# EAGLE design band-dsp-micro (EAGLE 7.3.0)
DATABASE: /Users/ingolia/Dropbox/Experiments/turbidostat/nephelometer/circuitry/partsdb.txt
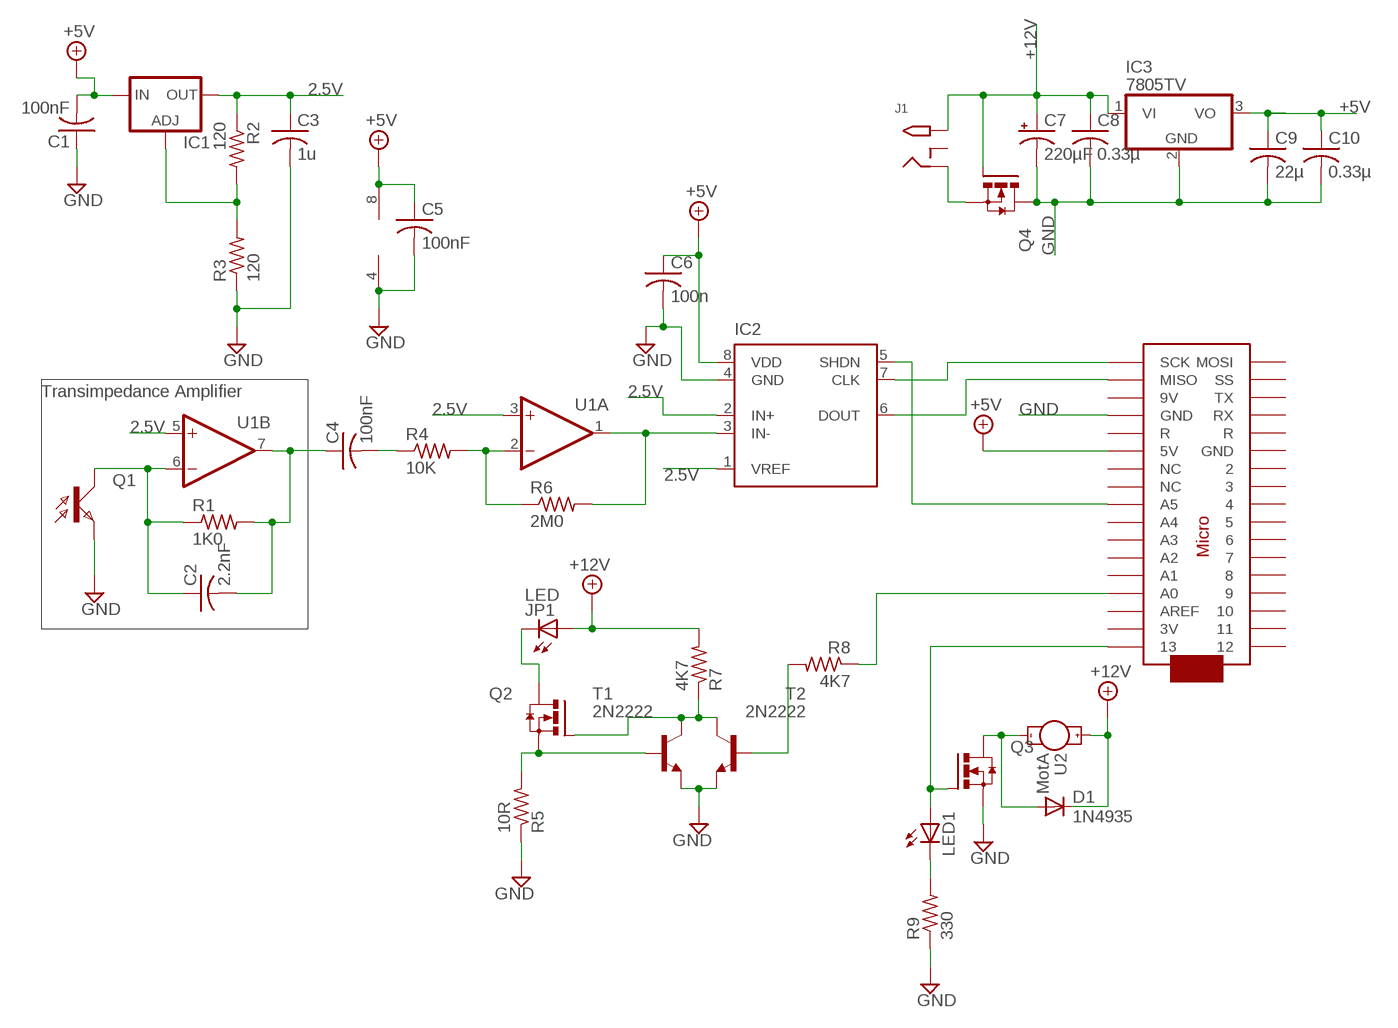
[diagram p0: schematic, sheet 1]

## Parts
C1  100nF  C-US025-025X050  [C025-025X050]
C2  2.2nF  C-US025-024X044  [C025-024X044]
C3  1u  C-US050-024X044  [C050-024X044]
C4  100nF  C-US025-060X050  [C025-060X050]
C5  100nF  C-US025-025X050  [C025-025X050]
C6  100n  C-US025-025X050  [C025-025X050]
C7  220µF  CPOL-USE3.5-8  [E3,5-8]
C8  0.33µ  C-US025-050X050  [C025-050X050]
C9  22µ  C-US050-045X075  [C050-045X075]
C10  0.33µ  C-US025-050X050  [C025-050X050]
D1  1N4935  1N4004  [DO41-10]
IC1  LM317L  [317L]
IC2  MCP3301  [DIL08]
IC3  7805TV  [TO220V]
J1  2.1MMJACKTHM  [PJ-102A]
JP1  LED  LED_CXN  [1X02_SCREW]
LED1  LED3MM  [LED3MM]
Q1  LTR-4206  [3MM_LED]
Q2  IRLB8721  [TO220BV]
Q3  IRLB8721  [TO220BV]
Q4  IRLB8721  [TO220BV]
R1  1K0  R-US_0204/5  [0204/5]
R2  120  R-US_0204/2V  [0204V]
R3  120  R-US_0204/2V  [0204V]
R4  10K  R-US_0204/5  [0204/5]
R5  10R  R-US_0204/2V  [0204V]
R6  2M0  R-US_0309/V  [0309V]
R7  4K7  R-US_0204/2V  [0204V]
R8  4K7  R-US_0204/2V  [0204V]
R9  330  R-US_0204/2V  [0204V]
T1  2N2222  [TO92-EBC-OVAL]
T2  2N2222  [TO92-EBC-OVAL]
U1  LMC6482  [DIL08]
U2  MotA  1X02_MOTOR  [1X02_SCREW]
U3  ARDUINOMICRO  [ARDUINOMICRO]

## Nets
2.5V: C3.1 IC1.2(OUT) IC2.1(VREF) IC2.2(IN+) R2.1 U1.3(A:+IN) U1.5(B:+IN)
+5V: C1.2 C5.1 C6.1 C9.1 C10.1 IC1.3(IN) IC2.8(VDD) IC3.3(VO) U1.8(P:V+) U3.P$23(5V)
+12V: C7.+ C8.1 D1.C IC3.1(VI) J1.TIP JP1.1/POS(A) Q4.G R7.2 U2.1/POS(+)
GND: C1.1 C3.2 C5.2 C6.2 C7.- C8.2 C9.2 C10.2 IC2.4(GND) IC3.2(GND) Q1.A(E) Q3.S Q4.D R3.1 R5.1 R9.1 T1.E T2.E U1.4(P:V-) U3.P$12(GND)
LEDCTRL: R8.2 T2.B
N$1: C2.1 Q1.K(C) R1.1 U1.6(B:-IN)
N$2: C4.2 R4.1
N$3: D1.A Q3.D U2.2(-)
N$4: IC2.6(DOUT) U3.P$19(MISO)
N$5: R8.1 U3.P$31(A0)
N$6: IC2.7(CLK) U3.P$18(SCK)
N$7: IC2.5(SHDN) U3.P$26(A5)
N$8: Q2.G R7.1 T1.C T2.C
N$14: Q2.S R5.2 T1.B
N$16: LED1.K(C) R9.2
N$18: JP1.2(K) Q2.D
N$19: LED1.A Q3.G U3.P$34
N$22: C2.2 C4.1 R1.2 U1.7(B:OUT)
N$25: R4.2 R6.1 U1.2(A:-IN)
N$26: IC2.3(IN-) R6.2 U1.1(A:OUT)
N$35: IC1.1(ADJ) R2.2 R3.2
N$47: J1.RING Q4.S
Unconnected: J1.RING_SW U3.P$1 U3.P$2 U3.P$3 U3.P$4 U3.P$5 U3.P$6 U3.P$7 U3.P$8 U3.P$9 U3.P$10 U3.P$11 U3.P$13(R) U3.P$14(RX) U3.P$15(TX) U3.P$16(SS) U3.P$17(MOSI) U3.P$20(9V) U3.P$21(GND) U3.P$22(R) U3.P$24(NC) U3.P$25(NC) U3.P$27(A4) U3.P$28(A3) U3.P$29(A2) U3.P$30(A1) U3.P$32(AREF) U3.P$33(3V)

## Notes on the sheet
- Transimpedance Amplifier

## Library data of the parts
C1 = adafruit:C-US: CAPACITOR, American symbol; DIGIKEY#: BC1084CT-ND; MANF: Vishay BC Components; MANF#: K104K15X7RF5TL2
C2 = adafruit:C-US: CAPACITOR, American symbol; DIGIKEY#: BC1029CT-ND; MANF: Vishay BC Components; MANF#: K222J15C0GF5TL2
C3 = adafruit:C-US: CAPACITOR, American symbol; DIGIKEY#: 445-8614-ND; MANF: TDK Corporation; MANF#: FK28X7R1C105K
C4 = adafruit:C-US: CAPACITOR, American symbol; DIGIKEY#: 445-8325-ND; MANF: TDK Corporation; MANF#: FK16C0G1H104J
C5 C6 = adafruit:C-US: CAPACITOR, American symbol; DIGIKEY#: BC1084CT-ND
C7 = adafruit:CPOL-US: POLARIZED CAPACITOR, American symbol; DIGIKEY#: P5166-ND; MANF: Panasonic Electronic Components; MANF#: ECA-1VM221
C8 C10 = adafruit:C-US: CAPACITOR, American symbol; DIGIKEY#: 445-5312-ND; MANF: TDK Corporation; MANF#: FK14X7R1H334K
C9 = adafruit:C-US: CAPACITOR, American symbol; DIGIKEY#: 445-8455-ND; MANF: TDK Corporation; MANF#: FK20X7R1C226M
D1 = adafruit:1N4004: DIODE General purpose 1N400x type rectifier (With bigger pads) http://www.ladyada.net/library/pcb/eaglelibrary.html; DIGIKEY#: 1N4935FSCT-ND; MANF: Fairchild Semiconductor; MANF#: 1N4935
IC1 = v-reg:LM317L: VOLTAGE REGULATOR; DIGIKEY#: 296-33312-5-ND; MANF: Texas Instruments; MANF#: LM317LCLP
IC2 = ingolia:MCP3301; DIGIKEY#: MCP3301-BI/P-ND; DIGIKEY2#: AE9986-ND; MANF: Microchip Technology; MANF#: MCP3301-BI/P
IC3 = linear:78*: Positive VOLTAGE REGULATOR Source: http://cache.national.com/ds/LM/LM78L05.pdf http://www.fairchildsemi.com/ds/LM/LM7805.pdf; DIGIKEY#: LM7805CT-ND; MANF: Fairchild Semiconductor; MANF#: LM7805CT
J1 = adafruit:2.1MMJACK: 2.1mm x 5.5mm THM DC jack with internal switch. Digikey part #PJ-102A, 4UCON part #05537 2.1mm x 5.5mm SMT DC jack with internal switch. Digikey part #PJ-002A-SMT, 4UCON part #03267 By microbuilder.eu & adafruit.com; DIGIKEY#: CP-102A-ND; DIGIKEY2#: T1071-P5P-ND; MANF: CUI Inc; MANF#: PJ-102A; MANF2: CUI Inc; MANF2#: EPSA120200U-P5P-SZ
JP1 = ingolia:LED_CXN; DIGIKEY#: 475-3002-ND; DIGIKEY2#: 492-1502-ND; MANF: OSRAM Opto Semiconductors Inc; MANF#: SFH 4547; MANF2: Bivar Inc; MANF2#: CR-174
LED1 = adafruit:LED: LED OSRAM: - CHIPLED LG R971, LG N971, LY N971, LG Q971, LY Q971, LO R971, LY R971 LH N974, LH R974 LS Q976, LO Q976, LY Q976 LO Q996 - Hyper CHIPLED LW Q18S LB Q993, LB Q99A, LB R99A - SideLED LS A670, LO A670, LY A670, LG A670, LP A670 LB A673, LV A673, LT A673, LW A673 LH A674 LY A675 LS A676, LA A676, LO A676, LY A676, LW A676 LS A679, LY A679, LG A679 - Hyper Micro SIDELED® LS Y876, LA Y876, LO Y876, LY Y876 LT Y87S - SmartLED LW L88C, LW L88S LB L89C, LB L89S, LG L890 LS L89K, LO L89K, LY L89K LS L896, LA L896, LO L896, LY L896 - TOPLED LS T670, LO T670, LY T670, LG T670, LP T670 LSG T670, LSP T670, LSY T670, LOP T670, LYG T670 LG T671, LOG T671, LSG T671 LB T673, LV T673, LT T673, LW T673 LH T674 LS T676, LA T676, LO T676, LY T676, LB T676, LH T676, LSB T676, LW T676 LB T67C, LV T67C, LT T67C, LS T67K, LO T67K, LY T67K, LW E67C LS E67B, LA E67B, LO E67B, LY E67B, LB E67C, LV E67C, LT E67C LW T67C LS T679, LY T679, LG T679 LS T770, LO T770, LY T770, LG T770, LP T770 LB T773, LV T773, LT T773, LW T773 LH T774 LS E675, LA E675, LY E675, LS T675 LS T776, LA T776, LO T776, LY T776, LB T776 LHGB T686 LT T68C, LB T68C - Hyper Mini TOPLED® LB M676 - Mini TOPLED Santana® LG M470 LS M47K, LO M47K, LY M47K Source: http://www.osram.convergy.de/; DIGIKEY#: 160-1139-ND; MANF: Lite-On Inc; MANF#: LTL-4221N
Q1 = ingolia:LTR-4206; DIGIKEY#: 160-1030-ND; MANF: Lite-On Inc; MANF#: LTR-4206E
Q2 = ingolia:IRLB8721; DIGIKEY#: IRLB8721PBF-ND
Q3 Q4 = ingolia:IRLB8721; DIGIKEY#: IRLB8721PBF-ND; MANF: International Rectifier; MANF#: IRLB8721PBF
R1 = adafruit:R-US_: RESISTOR, American symbol; DIGIKEY#: S1KCACT-ND; MANF: Stackpole Electronics Inc; MANF#: RNMF14FTC1K00
R2 R3 = adafruit:R-US_: RESISTOR, American symbol; DIGIKEY#: S120CACT-ND; MANF: Stackpole Electronics Inc; MANF#: RNMF14FTC120R
R4 = adafruit:R-US_: RESISTOR, American symbol; DIGIKEY#: S10KCACT-ND; MANF: Stackpole Electronics Inc; MANF#: RNMF14FTC10K0
R5 = adafruit:R-US_: RESISTOR, American symbol; DIGIKEY#: PPC10W-1CT-ND; MANF: Vishay BC Components; MANF#: PR01000101009JR500
R6 = adafruit:R-US_: RESISTOR, American symbol; DIGIKEY#: RNV14FAL2M00TB-ND; MANF: Stackpole Electronics Inc; MANF#: RNV14FAL2M00
R7 R8 = adafruit:R-US_: RESISTOR, American symbol; DIGIKEY#: S4.7KQCT-ND; MANF: Stackpole Electronics Inc; MANF#: CFM14JT4K70
R9 = adafruit:R-US_: RESISTOR, American symbol; DIGIKEY#: CF14JT330RCT-ND; MANF: Stackpole Electronics Inc; MANF#: CF14JT330R
T1 T2 = adafruit:2N2222: NPN TRANSISTOR Big oval pads; DIGIKEY#: PN2222ATFCT-ND; MANF: Fairchild Semiconductor; MANF#: PN2222ATF
U1 = ingolia:LMC6482; DIGIKEY#: LMC6482AIN/NOPB-ND; DIGIKEY2#: AE9986-ND; MANF: Texas Instruments; MANF#: LMC6482AIN/NOPB
U2 = ingolia:1X02_MOTOR; DIGIKEY#: SC1455-ND; MANF: Switchcraft Inc.; MANF#: 35PM1
U3 = adafruit:ARDUINOMICRO; DIGIKEY#: 1050-1066-ND; DIGIKEY2#: S7050-ND; DIGIKEY3#: S7050-ND; DIGIKEY4#: AE10419-ND; MANF: Arduino; MANF#: A000053; MANF2: Sullins Connector Solutions; MANF2#: PPPC171LFBN-RC; MANF3: Sullins Connector Solutions; MANF3#: PPPC171LFBN-RC; MANF4: Assmann WSW Components; MANF4#: AK67421-1

## Board
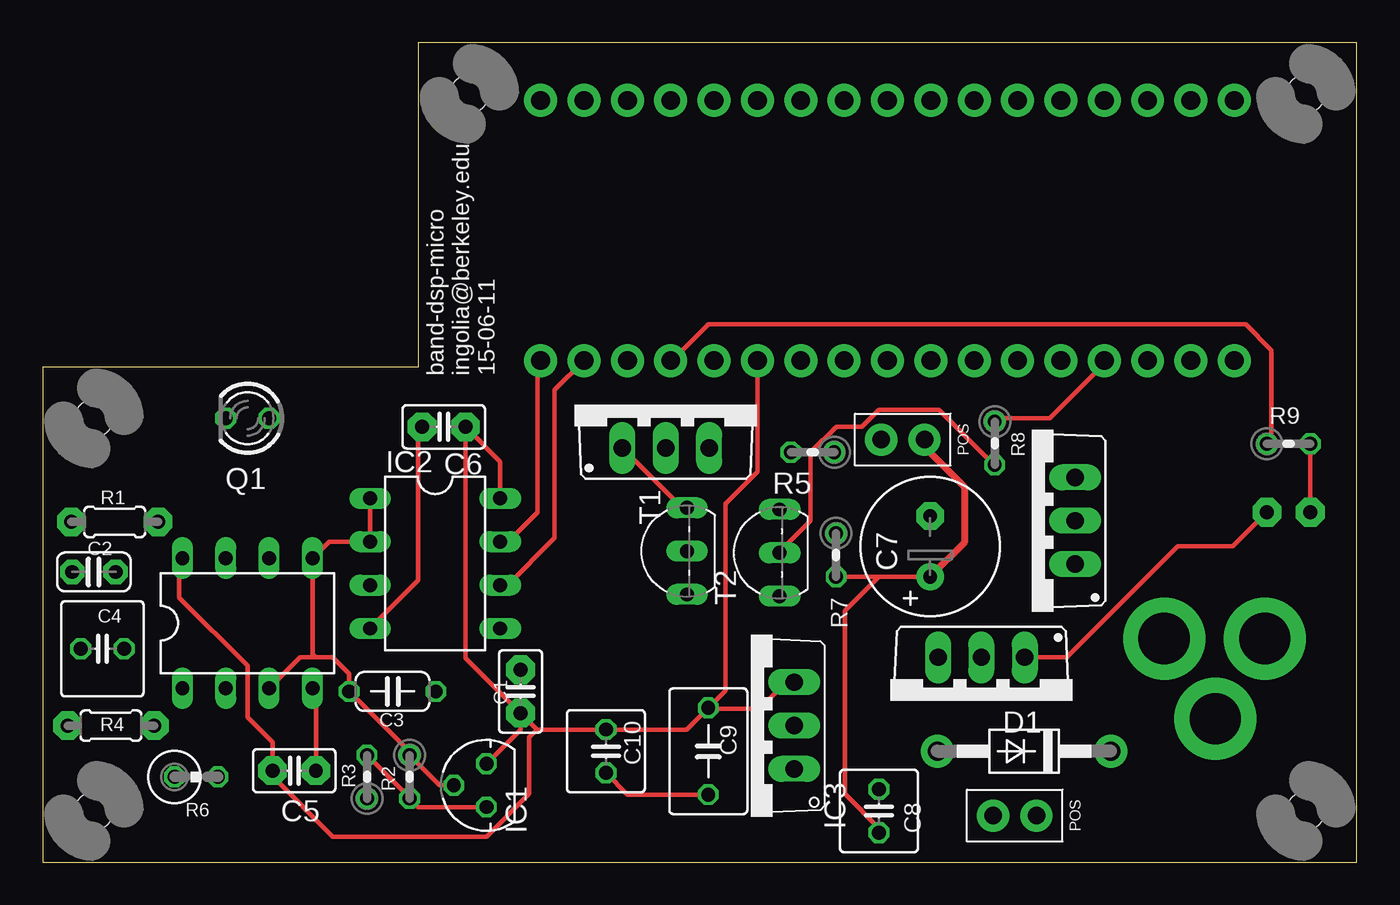
[diagram p1: board, top side]
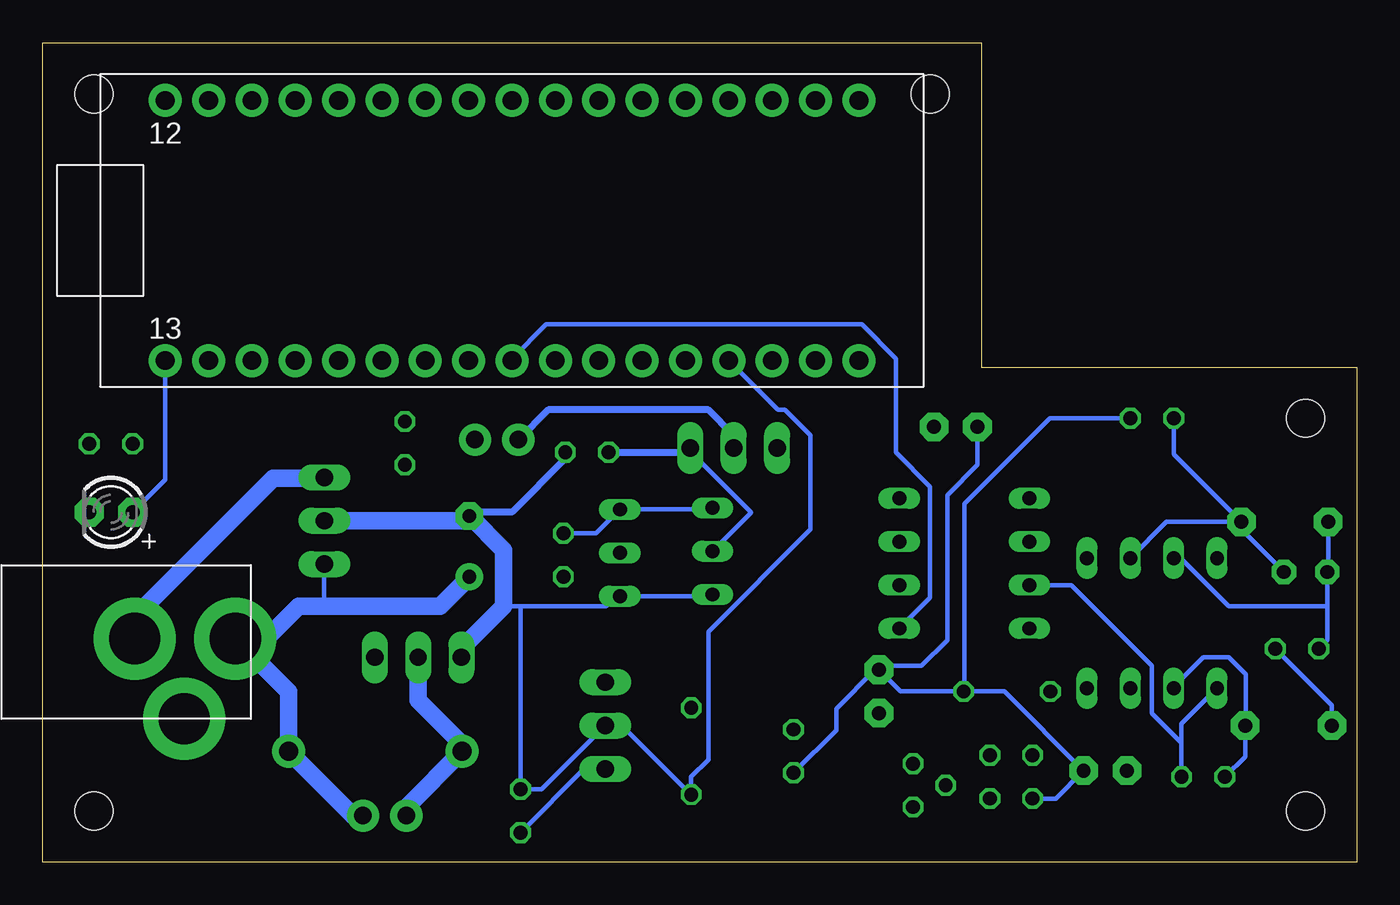
[diagram p2: board, bottom side, seen from below]

Size 77 x 48 mm. Coordinates in mm from the lower left corner, seen from the top.
Outline: 0,0 77,0 77,48 22,48 22,29 0,29 0,0
Copper layers (1*16): Top 0.0356mm / dielectric 1.5011mm / Bottom 0.0356mm
Design rules "OSHPark-LaenPCBOrder": minimum track width 6mil, minimum drill 13mil, track to track 6mil, track to pad 6mil, pad to pad 6mil, via to via 6mil, smd to smd 6mil, copper to edge 15mil, drill to drill 6mil, minimum pad ring 7mil, minimum via ring 7mil, stop-mask expansion 3mil, vias tented up to drill 0mil, thermal gap 10mil
tKeepout: area 7,21 to 17,29

### Footprints (pad centres in the part's own frame; a part is rotated, then mirrored left to right if it is on the bottom)
C025-025X050 = drill 0.813 pad 1.676 octagon: 1 -1.27,0; 2 1.27,0
C025-024X044 = drill 0.813 pad 1.422 octagon: 1 -1.27,0; 2 1.27,0
C050-024X044 = drill 0.813 octagon: 1 -2.54,0; 2 2.54,0
C025-060X050 = drill 0.813 octagon: 1 -1.27,0; 2 1.27,0
E3,5-8 = drill 0.813 pad 1.6: + -1.778,0 | drill 0.813 pad 1.6 octagon: - 1.778,0
C025-050X050 = drill 0.813 octagon: 1 -1.27,0; 2 1.27,0
C050-045X075 = drill 0.813 octagon: 1 -2.54,0; 2 2.54,0
DO41-10 = drill 1.118 pad 1.93: A 5.08,0; C -5.08,0
317L = drill 0.813 octagon: 1 -1.27,0; 2 0,1.905; 3 1.27,0
DIL08 = drill 0.813 long: 1 -3.81,-3.81; 2 -1.27,-3.81; 3 1.27,-3.81; 4 3.81,-3.81; 5 3.81,3.81; 6 1.27,3.81; 7 -1.27,3.81; 8 -3.81,3.81
TO220V = drill 1.016 long: 1 -2.54,-2.54; 2 0,-2.54; 3 2.54,-2.54
PJ-102A = drill 3 pad 4.8: RING 0.1,-3.39; RING_SW -4.6,-6.29; TIP 0.1,-9.29
1X02_SCREW = drill 1.016 pad 1.88: 1/POS 1.27,1.27; 2 3.81,1.27
LED3MM = drill 0.813 pad 1.676 octagon: A -1.27,0; K 1.27,0
3MM_LED = drill 0.813 octagon: A -1.27,0; K 1.27,0
TO220BV = drill 1.016 long: D 0,0; G -2.54,0; S 2.54,0
0204/5 = drill 0.813 pad 1.676 octagon: 1 -2.54,0; 2 2.54,0
0204V = drill 0.813 octagon: 1 -1.27,0; 2 1.27,0
0309V = drill 0.813 octagon: 1 -1.27,0; 2 1.27,0
TO92-EBC-OVAL = drill 0.813 long: B 0,-1.27; C 2.54,-1.27; E -2.54,-1.27
ARDUINOMICRO = drill 1.1 pad 1.93: P$1 -20.32,7.62; P$2 -17.78,7.62; P$3 -15.24,7.62; P$4 -12.7,7.62; P$5 -10.16,7.62; P$6 -7.62,7.62; P$7 -5.08,7.62; P$8 -2.54,7.62; P$9 0,7.62; P$10 2.54,7.62; P$11 5.08,7.62; P$12 12.7,-7.62; P$13 10.16,-7.62; P$14 12.7,7.62; P$15 15.24,7.62; P$16 17.78,7.62; P$17 20.32,7.62; P$18 20.32,-7.62; P$19 17.78,-7.62; P$20 15.24,-7.62; P$21 7.62,7.62; P$22 10.16,7.62; P$23 7.62,-7.62; P$24 5.08,-7.62; P$25 2.54,-7.62; P$26 0,-7.62; P$27 -2.54,-7.62; P$28 -5.08,-7.62; P$29 -7.62,-7.62; P$30 -10.16,-7.62; P$31 -12.7,-7.62; P$32 -15.24,-7.62; P$33 -17.78,-7.62; P$34 -20.32,-7.62
M2MOUNT = hole 2.2: 0,0

### Placement (x,y rotation side)
C1  28,10 270 top
C2  3,17 180 top
C3  20.5,10 0 top
C4  3.5,12.5 0 top
C5  14.74,5.36 0 top
C6  23.5,25.5 180 top
C7  52,18.5 90 top
C8  49,3 90 top
C9  39,6.5 270 top
C10  33,6.5 270 top
D1  57.5,6.5 180 top
IC1  26,4.5 90 top
IC2  23,17.5 270 top
IC3  41.5,8 90 top
J1  75,13 90 bottom
JP1  52.94,26.02 180 top
LED1  73,20.5 180 bottom
Q1  12,26 180 top
Q2  36.51,24.25 0 top
Q3  55,12 180 top
Q4  60.5,20 90 top
R1  4.22,19.93 180 top
R2  21.5,5 270 top
R3  19,5 90 top
R4  4,8 0 top
R5  45.11,24.01 180 top
R6  9,5 0 top
R7  46.49,17.99 270 top
R8  55.78,24.54 270 top
R9  73,24.5 0 top
T1  36.48,18.22 90 top
T2  41.91,18.12 90 top
U1  12,14 0 top
U2  59.5,4 180 top
U3  49.5,37 0 bottom
U$1  [M2MOUNT]  3,3 0 top
U$2  [M2MOUNT]  74,45 0 top
U$3  [M2MOUNT]  74,3 0 top
U$4  [M2MOUNT]  3,26 0 top
U$7  [M2MOUNT]  25,45 0 top

### Tracks (layer width: path | path; a pad name or v marks a point on that pad's centre or on a via)
2.5V
  Top 0.254: IC2.1 IC2.2 16.77,18.77 U1.5 15.81,12.19 16,12 | 16,12 17,12 17.96,11.04 C3.1 21.5,6.46 R2.1 23.27,4.5 IC1.2 | 16,12 15.08,12 U1.3
+5V
  Top 0.254: U1.8 8,17.62 8,15.5 12,11.5 12,8.5 13.47,7.03 C5.1 13.47,5.03 17,1.5 26,1.5 28.5,4 28.5,7.31 28.96,7.77 | C1.2 28,7.77 IC1.3 | C9.1 37.73,7.77 C10.1 28.96,7.77 | 28.96,7.77 C1.2 | C1.2 24.77,11.96 C6.1 26.81,23.46 IC2.8 | U3.P$23 41.88,22.88 40,21 40,10.04 C9.1 | IC3.3 43.54,10.54 42,9 39.04,9 C9.1
+12V
  Top 0.254: R7.2 49,16.72 | 49,16.72 C7.+ | C8.1 49,2 47,4 47,14.72 49,16.72
  Top 0.406: JP1.1/POS 51.67,24.33 54,22 54,18.72 C7.+
  Bottom 0.254: Q4.G 60.5,15 | IC3.1 45.27,5.46 C8.1
  Bottom 1.016: C7.+ 53.72,15 60.5,15 62,15 63.9,13.1 J1.TIP 62.58,9.97 D1.C 58.81,2.73 U2.1/POS
GND
  Top 0.254: C5.2 16.01,9.99 U1.4 | C9.2 34.27,3.96 C10.2 | IC2.4 22,16.5 22,24.77 22.23,25 C6.2 | R9.1 72,24.5 72,30 70.5,31.5 39,31.5 37,29.5 U3.P$12
  Bottom 0.254: C3.2 20.65,10 C5.2 17.64,3.73 R3.1 | Q1.A 18,26 23,21 23,10.04 C3.2 | C1.1 28.23,11.27 30.5,9 30.5,7.73 C10.2 | C3.2 26.73,10 C1.1 | C6.2 22.23,23.27 24,21.5 24,13 25.5,11.5 27.77,11.5 C1.1 | T1.E 37.85,15.58 T2.E 43.42,15.58 44,15 49,15 | U3.P$12 33.92,26.5 33.5,26.5 32,25 32,19.5 38,13.5 38,6 39,5 C9.2 43.04,8 IC3.2 47.77,4.27 C8.2 49,15 | 49,15 50,15
  Bottom 0.406: R5.1 46.38,23.62 49.5,20.5 51.78,20.5 C7.-
  Bottom 1.016: Q4.D 52.28,20 C7.- 50,18.28 50,15 52.46,12.54 Q3.S
LEDCTRL
  Top 0.254: R8.2 55.5,23.5 52.5,26.5 49,26.5 48,25.5 46.5,25.5 45,24 45,20 43.5,18.5 T2.B
N$1
  Bottom 0.254: Q1.K 10.73,23.9 R1.1 | R1.1 11.15,19.93 U1.6 | R1.1 6.76,19.49 C2.1
N$2
  Bottom 0.254: R4.1 1.46,9.19 C4.2
N$3
  Bottom 1.016: U2.2 55.69,3.23 D1.A 52.42,6.92 55,9.5 Q3.D
N$4
  Top 0.254: IC2.6 27.23,16.23 30,19 30,27.66 U3.P$19
N$5
  Top 0.254: U3.P$31 62.2,29.2 59,26 55.97,26 R8.1
N$6
  Top 0.254: IC2.7 27.27,18.77 29,20.5 29,29.2 U3.P$18
N$7
  Bottom 0.254: U3.P$26 49.5,29.5 47.5,31.5 29,31.5 27,29.5 27,24 25,22 25,15.5 IC2.5
N$8
  Top 0.254: T1.C 37.46,20.76 Q2.G
  Bottom 0.254: T1.C 37.85,20.66 T2.C 44.58,19.26 R7.1
N$14
  Bottom 0.254: Q2.S 39.05,24.05 35.5,20.5 35.5,20.47 T1.B
  Bottom 0.406: R5.2 39.29,24.01 Q2.S
N$16
  Top 0.254: R9.2 LED1.K
N$18
  Bottom 0.406: Q2.D 36.51,25.01 38,26.5 47.38,26.5 JP1.2
N$19
  Top 0.254: Q3.G 60,12 66.5,18.5 69.73,18.5 LED1.A
  Bottom 0.254: U3.P$34 69.82,22.41 LED1.A
N$22
  Bottom 0.254: R1.2 1.68,17.05 C2.2 1.73,15 | 1.73,15 1.73,13 C4.1 | U1.7 10.31,17.81 7.5,15 1.73,15
N$25
  Bottom 0.254: R6.1 6.54,6.19 R4.2 6.5,8.04 6.5,11 7.5,12 9,12 10.73,10.27 U1.2
N$26
  Bottom 0.254: R6.2 10.27,7 | 10.27,7 10.27,8.11 U1.1 | IC2.3 16.73,16.23 12,11.5 12,8.73 10.27,7
N$35
  Top 0.254: IC1.1 22,3.23 R2.2 21.5,3.77 R3.2
N$47
  Bottom 1.016: J1.RING 71.61,14.39 63.5,22.5 60.54,22.5 Q4.S

### Text on the board
tPlace: band-dsp-micro / ingolia@berkeley.edu / 15-06-11